# Altium project 通用目标控制板-中.PrjPcb
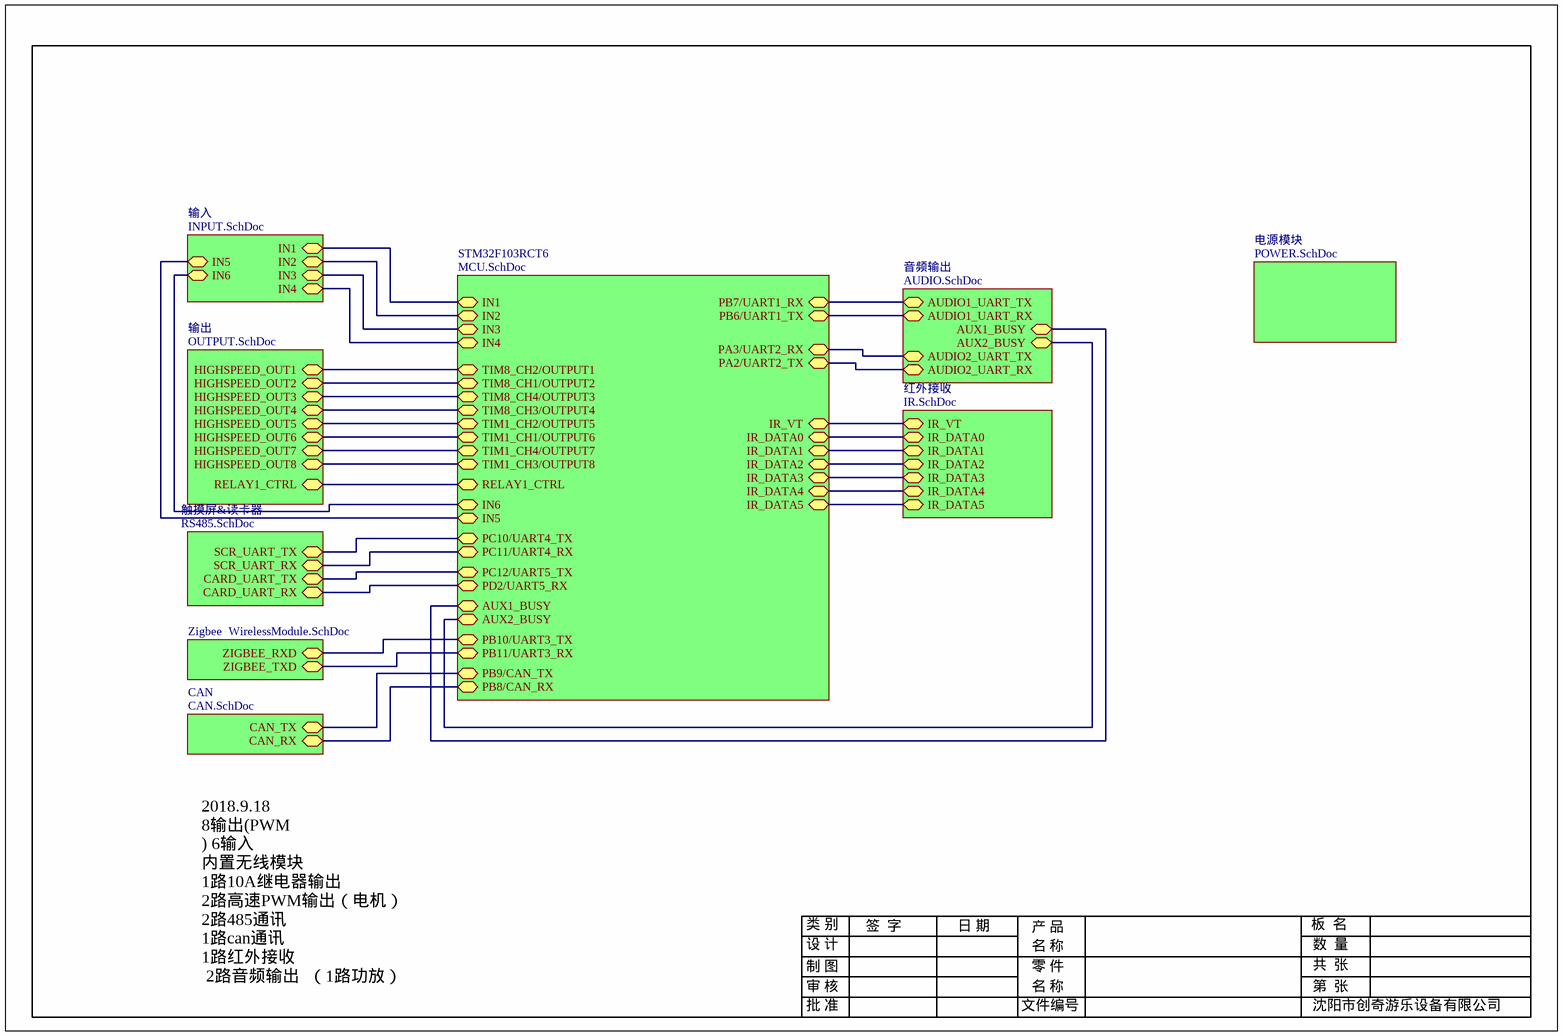
[diagram p0: TOP.SchDoc]
10 sheets, 184 parts. Net scope: hierarchical (ports join the sheet entries above them; power ports are global).
Board file: G12-1A-D-1-2-6-2 目标控制板PCB.PcbDoc
Sheets:
  TOP.SchDoc
    音频输出 = AUDIO.SchDoc
    输入 = INPUT.SchDoc
    红外接收 = IR.SchDoc
    输出 = OUTPUT.SchDoc
    电源模块 = POWER.SchDoc
    STM32F103RCT6 = MCU.SchDoc
    CAN = CAN.SchDoc
    触摸屏&读卡器 = RS485.SchDoc
    Zigbee = WirelessModule.SchDoc

## Sheet TOP.SchDoc
size A4

### Sub-sheets
CAN = CAN.SchDoc: CAN_RX, CAN_TX
STM32F103RCT6 = MCU.SchDoc: TIM8_CH2/OUTPUT1, TIM8_CH1/OUTPUT2, TIM8_CH4/OUTPUT3, TIM8_CH3/OUTPUT4, TIM1_CH2/OUTPUT5, TIM1_CH1/OUTPUT6, TIM1_CH4/OUTPUT7, TIM1_CH3/OUTPUT8, IR_DATA2 (bidir), IR_DATA3 (bidir), IR_DATA5 (bidir), IR_DATA4 (bidir), IR_DATA1 (bidir), IR_DATA0 (bidir), IR_VT (bidir), RELAY1_CTRL (bidir), IN6, IN5, PB8/CAN_RX, PB9/CAN_TX, PC12/UART5_TX, PD2/UART5_RX, AUX1_BUSY, AUX2_BUSY, PC10/UART4_TX, PC11/UART4_RX, IN4, IN3, IN1, IN2, PA3/UART2_RX, PA2/UART2_TX, PB6/UART1_TX, PB7/UART1_RX, PB10/UART3_TX, PB11/UART3_RX
Zigbee = WirelessModule.SchDoc: ZIGBEE_RXD, ZIGBEE_TXD
电源模块 = POWER.SchDoc: no entries
红外接收 = IR.SchDoc: IR_DATA5 (bidir), IR_VT (bidir), IR_DATA0 (bidir), IR_DATA2 (bidir), IR_DATA3 (bidir), IR_DATA4 (bidir), IR_DATA1 (bidir)
触摸屏&读卡器 = RS485.SchDoc: CARD_UART_RX (bidir), CARD_UART_TX (bidir), SCR_UART_TX (bidir), SCR_UART_RX (bidir)
输入 = INPUT.SchDoc: IN2, IN4, IN3, IN1, IN5, IN6
输出 = OUTPUT.SchDoc: HIGHSPEED_OUT1 (bidir), HIGHSPEED_OUT2 (bidir), HIGHSPEED_OUT3 (bidir), HIGHSPEED_OUT4 (bidir), HIGHSPEED_OUT6 (bidir), HIGHSPEED_OUT5 (bidir), HIGHSPEED_OUT7 (bidir), HIGHSPEED_OUT8 (bidir), RELAY1_CTRL (bidir)
音频输出 = AUDIO.SchDoc: AUX1_BUSY, AUX2_BUSY, AUDIO1_UART_TX (bidir), AUDIO1_UART_RX (bidir), AUDIO2_UART_RX (bidir), AUDIO2_UART_TX (bidir)

### Nets
NetR1_2: sheet 输入/IN6, sheet STM32F103RCT6/IN6
NetR2_2: sheet 输入/IN5, sheet STM32F103RCT6/IN5
NetR37_2: sheet 输出/RELAY1_CTRL, sheet STM32F103RCT6/RELAY1_CTRL
NetR52_1: sheet STM32F103RCT6/PC11/UART4_RX, sheet 触摸屏&读卡器/SCR_UART_RX
NetR55_2: sheet STM32F103RCT6/PC10/UART4_TX, sheet 触摸屏&读卡器/SCR_UART_TX
NetR58_1: sheet STM32F103RCT6/PD2/UART5_RX, sheet 触摸屏&读卡器/CARD_UART_RX
NetR61_2: sheet STM32F103RCT6/PC12/UART5_TX, sheet 触摸屏&读卡器/CARD_UART_TX
NetRP2_2: sheet 输入/IN4, sheet STM32F103RCT6/IN4
NetRP2_3: sheet 输入/IN3, sheet STM32F103RCT6/IN3
NetRP2_4: sheet 输入/IN2, sheet STM32F103RCT6/IN2
NetRP2_5: sheet 输入/IN1, sheet STM32F103RCT6/IN1
NetSW2_1: sheet STM32F103RCT6/PB10/UART3_TX, sheet Zigbee/ZIGBEE_RXD
NetSW2_3: sheet STM32F103RCT6/PB11/UART3_RX, sheet Zigbee/ZIGBEE_TXD
NetU2_7: sheet 音频输出/AUDIO1_UART_TX, sheet STM32F103RCT6/PB7/UART1_RX
NetU2_8: sheet 音频输出/AUDIO1_UART_RX, sheet STM32F103RCT6/PB6/UART1_TX
NetU2_9: sheet 音频输出/AUX1_BUSY, sheet STM32F103RCT6/AUX1_BUSY
NetU3_7: sheet 音频输出/AUDIO2_UART_TX, sheet STM32F103RCT6/PA3/UART2_RX
NetU3_8: sheet 音频输出/AUDIO2_UART_RX, sheet STM32F103RCT6/PA2/UART2_TX
NetU3_9: sheet 音频输出/AUX2_BUSY, sheet STM32F103RCT6/AUX2_BUSY
NetU4_1: sheet STM32F103RCT6/PB9/CAN_TX, sheet CAN/CAN_TX
NetU4_4: sheet STM32F103RCT6/PB8/CAN_RX, sheet CAN/CAN_RX
NetU6_7: sheet 红外接收/IR_DATA5, sheet STM32F103RCT6/IR_DATA5
NetU6_8: sheet 红外接收/IR_DATA4, sheet STM32F103RCT6/IR_DATA4
NetU6_12: sheet 红外接收/IR_DATA3, sheet STM32F103RCT6/IR_DATA3
NetU6_13: sheet 红外接收/IR_DATA2, sheet STM32F103RCT6/IR_DATA2
NetU6_14: sheet 红外接收/IR_DATA1, sheet STM32F103RCT6/IR_DATA1
NetU6_15: sheet 红外接收/IR_DATA0, sheet STM32F103RCT6/IR_DATA0
NetU6_19: sheet 红外接收/IR_VT, sheet STM32F103RCT6/IR_VT
NetU8_29: sheet 输出/HIGHSPEED_OUT1, sheet STM32F103RCT6/TIM8_CH2/OUTPUT1
NetU8_30: sheet 输出/HIGHSPEED_OUT2, sheet STM32F103RCT6/TIM8_CH1/OUTPUT2
NetU8_31: sheet 输出/HIGHSPEED_OUT3, sheet STM32F103RCT6/TIM8_CH4/OUTPUT3
NetU8_32: sheet 输出/HIGHSPEED_OUT4, sheet STM32F103RCT6/TIM8_CH3/OUTPUT4
NetU8_33: sheet 输出/HIGHSPEED_OUT5, sheet STM32F103RCT6/TIM1_CH2/OUTPUT5
NetU8_34: sheet 输出/HIGHSPEED_OUT6, sheet STM32F103RCT6/TIM1_CH1/OUTPUT6
NetU8_35: sheet 输出/HIGHSPEED_OUT7, sheet STM32F103RCT6/TIM1_CH4/OUTPUT7
NetU8_36: sheet 输出/HIGHSPEED_OUT8, sheet STM32F103RCT6/TIM1_CH3/OUTPUT8

### Notes on the sheet
- 2018.9.18
  8输出(PWM
  ) 6输入
  内置无线模块
  1路10A继电器输出
  2路高速PWM输出（电机）
  2路485通讯
  1路can通讯
  1路红外接收
  2路音频输出  （1路功放）
- 设 计
- 制 图
- 审 核
- 类 别
- 签  字
- 日 期
- 产 品
- 名 称
- 零 件
- 板  名
- 数  量
- 共  张
- 第  张
- 批 准
- 文件编号
- 沈阳市创奇游乐设备有限公司

## Sheet AUDIO.SchDoc
size A4
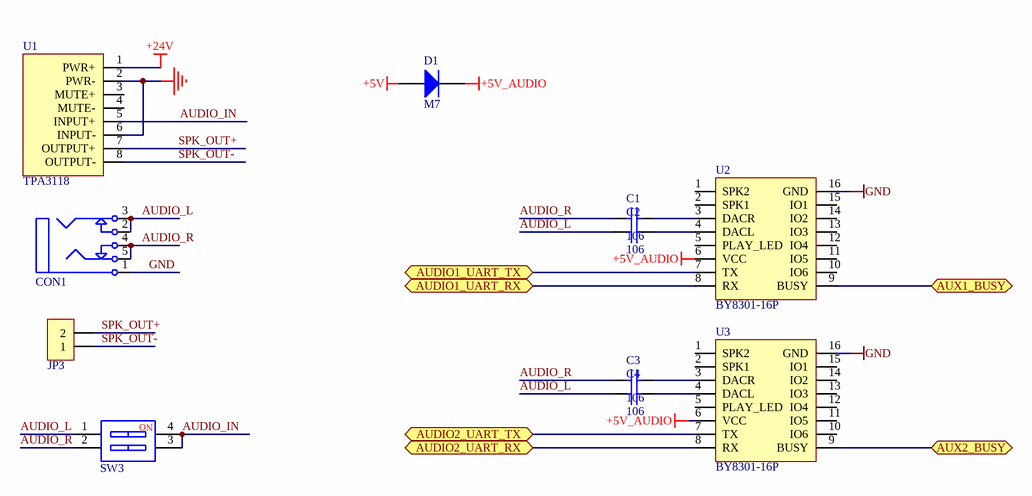
[diagram p1: AUDIO.SchDoc]

### Parts
C1  106  [C 1206]
C2  106  [C 1206]
C3  106  [C 1206]
C4  106  [C 1206]
CON1  PJ325_BK  [PJ325_PK]  (value not drawn)
D1  M7  [SMA]
JP3  AUX  [557-2X1]  (value not drawn)
SW3  CSW-2P  [CSW1.27 SMD-2P]  (value not drawn)
U1  TPA3118  [TPA3118-L]
U2  BY8301-16P  [BY8301-16P]
U3  BY8301-16P  [BY8301-16P]

### Ports
AUDIO1_UART_RX (bidir), AUDIO1_UART_TX (bidir), AUDIO2_UART_RX (bidir), AUDIO2_UART_TX (bidir), AUX1_BUSY, AUX2_BUSY

### Nets
+5V: D1.1
+5V_AUDIO: D1.2 U2.6(VCC) U3.6(VCC)
+24V: U1.1(PWR+)
GND: CON1.1 U1.2(PWR-) U1.6(INPUT-) U2.16(GND) U3.16(GND)
AUDIO_IN: SW3.3 SW3.4 U1.5(INPUT+)
AUDIO_L: C2.1 C4.1 CON1.2 CON1.3 SW3.1
AUDIO_R: C1.1 C3.1 CON1.4 CON1.5 SW3.2
SPK_OUT+: JP3.2 U1.7(OUTPUT+)
SPK_OUT-: JP3.1 U1.8(OUTPUT-)
NetC1_2: C1.2 U2.3(DACR)
NetC2_2: C2.2 U2.4(DACL)
NetC3_2: C3.2 U3.3(DACR)
NetC4_2: C4.2 U3.4(DACL)
NetU2_7: U2.7(TX) ; port AUDIO1_UART_TX
NetU2_8: U2.8(RX) ; port AUDIO1_UART_RX
NetU2_9: U2.9(BUSY) ; port AUX1_BUSY
NetU3_7: U3.7(TX) ; port AUDIO2_UART_TX
NetU3_8: U3.8(RX) ; port AUDIO2_UART_RX
NetU3_9: U3.9(BUSY) ; port AUX2_BUSY

Not connected (* = marked no-connect by the designer): U1 3(MUTE+) 4(MUTE-); U2 1(SPK2) 2(SPK1) 5(PLAY_LED) 10(IO6) 11(IO5) 12(IO4) 13(IO3) 14(IO2) 15(IO1); U3 1(SPK2) 2(SPK1) 5(PLAY_LED) 10(IO6) 11(IO5) 12(IO4) 13(IO3) 14(IO2) 15(IO1)

### Notes on the sheet
- 设 计
- 制 图
- 审 核
- 类 别
- 签  字
- 日 期
- 产 品
- 名 称
- 零 件
- 板  名
- 数  量
- 共  张
- 第  张
- 批 准
- 文件编号
- 沈阳市创奇游乐设备有限公司
- (in symbol CSW-2P) NO

### Library data of the parts
C1-C4 = Cap: Capacitor; Published: 8-Jun-2000; LatestRevisionDate: 17-Jul-2002; LatestRevisionNote: Re-released for DXP Platform.; Publisher: Altium Limited
CON1 = PJ325: 3.5mm耳机插座; BOM名称: 耳机插座; 版权归属: 源创客; 学习资源: www.ooocke.com
D1 = Diode
JP3 = Header 2: 2P接插件; 版权归属: 源创客; BOM名称: 2P接插件; 学习资源: www.ooocke.com
SW3 = CSW-2P: 2路编码开关; 版权归属: 源创客; BOM名称: 2路编码开关; 学习资源: www.ooocke.com
U1 = TPA3118: TPA3118单声道功放板
U2 U3 = BY8301-16P: BY8001-16P语音模块

## Sheet INPUT.SchDoc
size A4
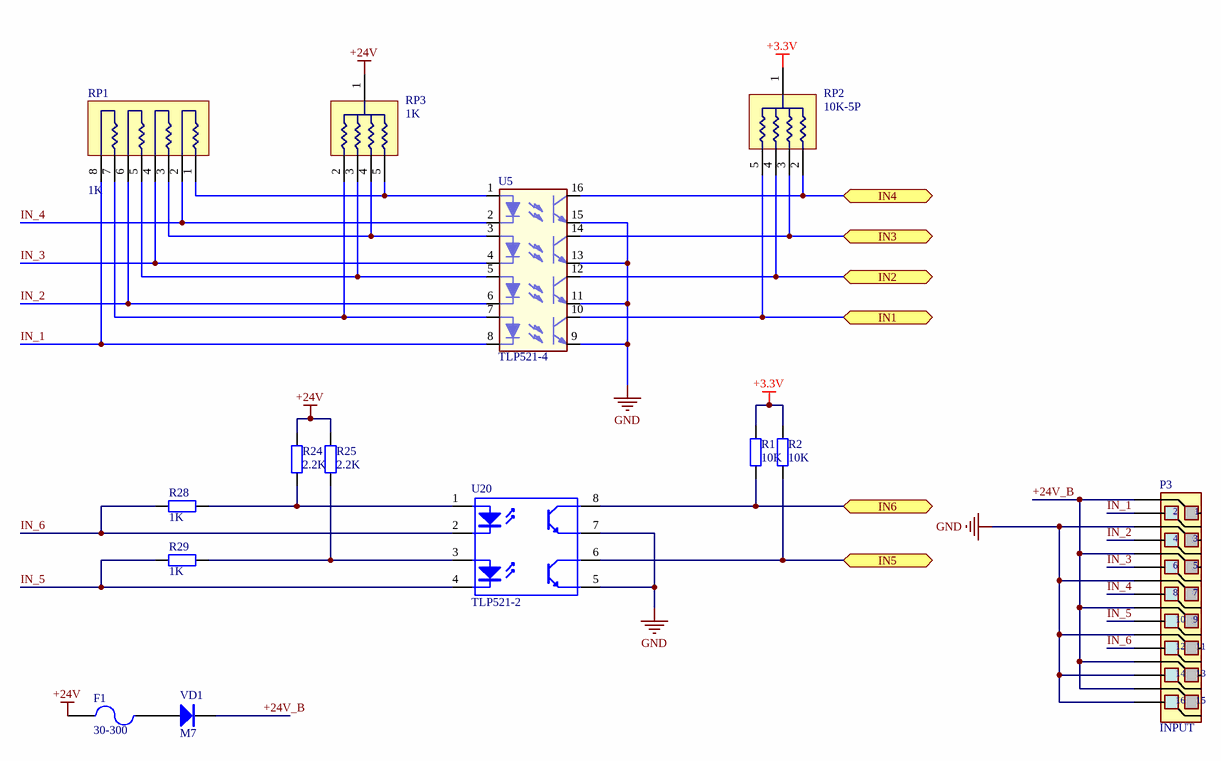
[diagram p2: INPUT.SchDoc]

### Parts
F1  30-300  [FU 1812]
P3  INPUT  [557-2x8]
R1  10K  [R 0805]
R2  10K  [R 0805]
R24  2.2K  [R 0805]
R25  2.2K  [R 0805]
R28  1K  [R 0805]
R29  1K  [R 0805]
RP1  1K  [HDR1X8_1]
RP2  10K-5P  [HDR1X5_1]
RP3  1K  [HDR1X5_1]
U5  TLP521-4  [DIP16-300_MH]
U20  TLP521-2  [DIP8-300_MH]
VD1  M7  [SMA]

### Ports
IN1, IN2, IN3, IN4, IN5, IN6

### Nets
+3.3V: R1.1 R2.1 RP2.1
+24V: F1.1 R24.1 R25.1 RP3.1
GND: P3.3 P3.7 P3.11 P3.14 P3.16 U5.9 U5.11 U5.13 U5.15 U20.5(2E) U20.7(1E)
+24V_B: P3.1 P3.5 P3.9 P3.13 P3.15 VD1.2(K)
IN_1: P3.2 RP1.8 U5.8
IN_2: P3.4 RP1.6 U5.6
IN_3: P3.6 RP1.4 U5.4
IN_4: P3.8 RP1.2 U5.2
IN_5: P3.10 R29.1 U20.4(2K)
IN_6: P3.12 R28.1 U20.2(1K)
NetF1_2: F1.2 VD1.1(A)
NetR1_2: R1.2 U20.8(1C) ; port IN6
NetR2_2: R2.2 U20.6(2C) ; port IN5
NetR24_2: R24.2 R28.2 U20.1(1A)
NetR25_2: R25.2 R29.2 U20.3(2A)
NetRP1_1: RP1.1 RP3.5 U5.1
NetRP1_3: RP1.3 RP3.4 U5.3
NetRP1_5: RP1.5 RP3.3 U5.5
NetRP1_7: RP1.7 RP3.2 U5.7
NetRP2_2: RP2.2 U5.16 ; port IN4
NetRP2_3: RP2.3 U5.14 ; port IN3
NetRP2_4: RP2.4 U5.12 ; port IN2
NetRP2_5: RP2.5 U5.10 ; port IN1

### Notes on the sheet
- 设 计
- 制 图
- 审 核
- 类 别
- 签  字
- 日 期
- 产 品
- 名 称
- 零 件
- 板  名
- 数  量
- 共  张
- 第  张
- 批 准
- 文件编号
- 沈阳市创奇游乐设备有限公司

### Library data of the parts
F1 = Fuse 2: Fuse; Published: 8-Jun-2000; LatestRevisionDate: 17-Jul-2002; LatestRevisionNote: Re-released for DXP Platform.; PackageReference: PIN-W2/E2.8; Publisher: Altium Limited
P3 = 557-2x8: 接插件
R1 R2 R24 R25 R28 R29 = Res1
RP1 = Res_Pack4_SIP8
RP2 RP3 = Res4
U5 = OPTOISOLATOR1_4A
U20 = TLP521-2: 2路开关光耦; 版权归属: 源创客; BOM名称: 2路开关光耦; 学习资源: www.ooocke.com
VD1 = M7: 整流二极管; 版权归属: 源创客; BOM名称: 整流二极管; 学习资源: www.ooocke.com

## Sheet IR.SchDoc
size A4
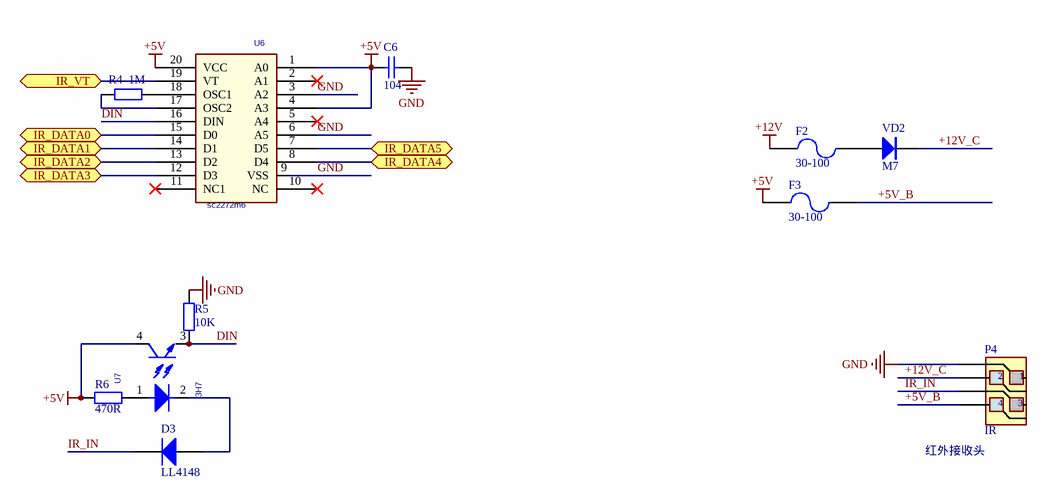
[diagram p3: IR.SchDoc]

### Parts
C6  104  [C 0805]
D3  LL4148  [MINI_MELF (LL34)]
F2  30-100  [FU 1812]
F3  30-100  [FU 1812]
P4  IR  [557-2x2]
R4  1M  [R 0805]
R5  10K  [R 0805]
R6  470R  [R 0805]
U6  sc2272m6  [SOP20_N]
U7  3H7  [SOP4_3H7]
VD2  M7  [SMA]

### Ports
IR_DATA0 (bidir), IR_DATA1 (bidir), IR_DATA2 (bidir), IR_DATA3 (bidir), IR_DATA4 (bidir), IR_DATA5 (bidir), IR_VT (bidir)

### Nets
+5V: C6.2 F3.1 R6.2 U6.1(A0) U6.4(A3) U6.20(VCC) U7.4(COLLECTOR)
+12V: F2.1
GND: C6.1 P4.1 R5.2 U6.3(A2) U6.6(A5) U6.9(VSS)
+5V_B: F3.2 P4.4
+12V_C: P4.2 VD2.2(K)
DIN: R5.1 U6.16(DIN) U7.3(EMITTER)
IR_IN: D3.2 P4.3
NetD3_1: D3.1 U7.2(CATHODE)
NetF2_2: F2.2 VD2.1(A)
NetR4_1: R4.1 U6.17(OSC2)
NetR4_2: R4.2 U6.18(OSC1)
NetR6_1: R6.1 U7.1(ANODE)
NetU6_7: U6.7(D5) ; port IR_DATA5
NetU6_8: U6.8(D4) ; port IR_DATA4
NetU6_12: U6.12(D3) ; port IR_DATA3
NetU6_13: U6.13(D2) ; port IR_DATA2
NetU6_14: U6.14(D1) ; port IR_DATA1
NetU6_15: U6.15(D0) ; port IR_DATA0
NetU6_19: U6.19(VT) ; port IR_VT

Not connected (* = marked no-connect by the designer): U6 2(A1)* 5(A4)* 10(NC)* 11(NC1)*

### Notes on the sheet
- (near P4) 红外接收头
- 设 计
- 制 图
- 审 核
- 类 别
- 签  字
- 日 期
- 产 品
- 名 称
- 零 件
- 板  名
- 数  量
- 共  张
- 第  张
- 批 准
- 文件编号
- 沈阳市创奇游乐设备有限公司

### Library data of the parts
C6 = Cap1
D3 = Diode
F2 F3 = Fuse 2: Fuse; Published: 8-Jun-2000; LatestRevisionDate: 17-Jul-2002; LatestRevisionNote: Re-released for DXP Platform.; PackageReference: PIN-W2/E2.8; Publisher: Altium Limited
P4 = 557-2x2: 接插件
R4 = Res2: Resistor; Published: 8-Jun-2000; LatestRevisionDate: 17-Jul-2002; LatestRevisionNote: Re-released for DXP Platform.; Publisher: Altium Limited
R5 R6 = Res1
U6 = PT2272_L6S
U7 = PS2801-1/SM
VD2 = M7: 整流二极管; 版权归属: 源创客; BOM名称: 整流二极管; 学习资源: www.ooocke.com

## Sheet OUTPUT.SchDoc
size A4
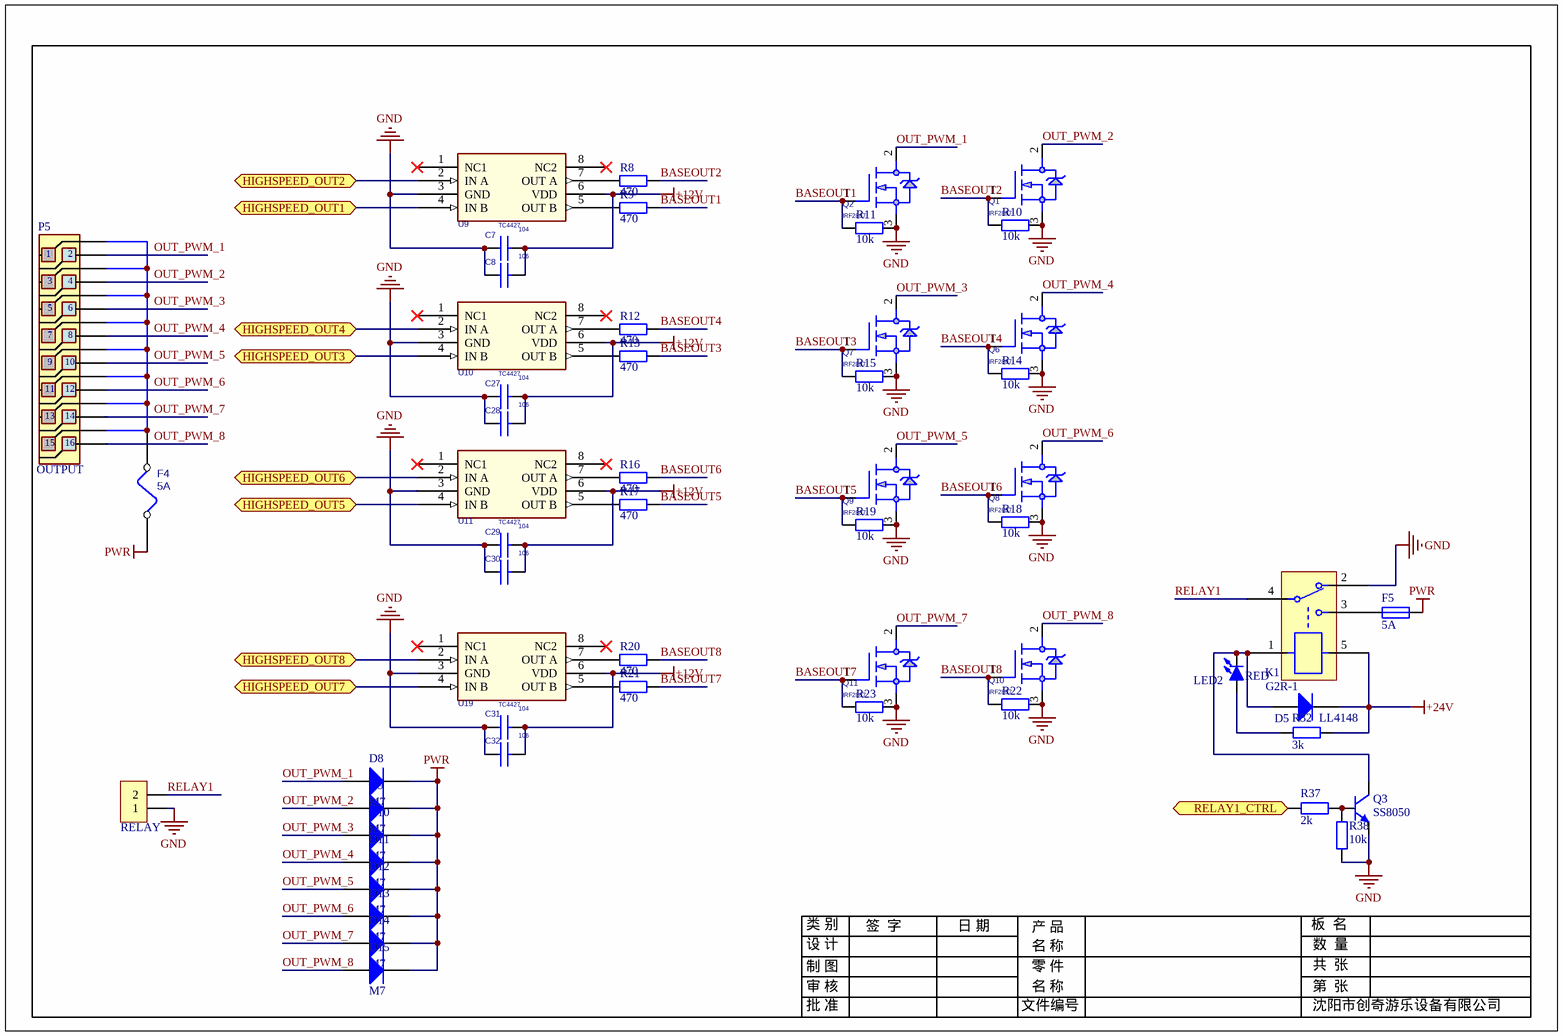
[diagram p4: OUTPUT.SchDoc]

### Parts
C7  104  [C 0805]
C8  106  [C 0805]
C27  104  [C 0805]
C28  106  [C 0805]
C29  104  [C 0805]
C30  106  [C 0805]
C31  104  [C 0805]
C32  106  [C 0805]
D5  LL4148  [MINI_MELF (LL34)]
D8  M7  [SMA]
D9  M7  [SMA]
D10  M7  [SMA]
D11  M7  [SMA]
D12  M7  [SMA]
D13  M7  [SMA]
D14  M7  [SMA]
D15  M7  [SMA]
F4  5A  [FUSEe-CAR]
F5  5A  [FUSEe-CAR]
K1  G2R-1  [RELAY_OMRON_G2R]
LED2  RED  [LED 3MM-R]
P5  OUTPUT  [557-2x8]
Q1  IRF2807  [TO220A]
Q2  IRF2807  [TO220A]
Q3  SS8050  [SOT23-3N]
Q6  IRF2807  [TO220A]
Q7  IRF2807  [TO220A]
Q8  IRF2807  [TO220A]
Q9  IRF2807  [TO220A]
Q10  IRF2807  [TO220A]
Q11  IRF2807  [TO220A]
R8  470  [R 0805]
R9  470  [R 0805]
R10  10k  [R 0805]
R11  10k  [R 0805]
R12  470  [R 0805]
R13  470  [R 0805]
R14  10k  [R 0805]
R15  10k  [R 0805]
R16  470  [R 0805]
R17  470  [R 0805]
R18  10k  [R 0805]
R19  10k  [R 0805]
R20  470  [R 0805]
R21  470  [R 0805]
R22  10k  [R 0805]
R23  10k  [R 0805]
R32  3k  [R 0805]
R37  2k  [R 0805]
R38  10k  [R 0805]
RELAY  AUX  [557-2X1]  (value not drawn)
U9  TC4427  [SO8]
U10  TC4427  [SO8]
U11  TC4427  [SO8]
U19  TC4427  [SO8]

### Ports
HIGHSPEED_OUT1 (bidir), HIGHSPEED_OUT2 (bidir), HIGHSPEED_OUT3 (bidir), HIGHSPEED_OUT4 (bidir), HIGHSPEED_OUT5 (bidir), HIGHSPEED_OUT6 (bidir), HIGHSPEED_OUT7 (bidir), HIGHSPEED_OUT8 (bidir), RELAY1_CTRL (bidir)

### Nets
+12V: C7.2 C8.2 C27.2 C28.2 C29.2 C30.2 C31.2 C32.2 U9.6(VDD) U10.6(VDD) U11.6(VDD) U19.6(VDD)
+24V: D5.2 K1.5 R32.1
GND: C7.1 C8.1 C27.1 C28.1 C29.1 C30.1 C31.1 C32.1 K1.2 Q1.3(S) Q2.3(S) Q3.2(E) Q6.3(S) Q7.3(S) Q8.3(S) Q9.3(S) Q10.3(S) Q11.3(S) R10.2 R11.2 R14.2 R15.2 R18.2 R19.2 R22.2 R23.2 R38.2 RELAY.1 U9.3(GND) U10.3(GND) U11.3(GND) U19.3(GND)
PWR: D8.2 D9.2 D10.2 D11.2 D12.2 D13.2 D14.2 D15.2 F4.1 F5.2
BASEOUT1: Q2.1(G) R9.2 R11.1
BASEOUT2: Q1.1(G) R8.2 R10.1
BASEOUT3: Q7.1(G) R13.2 R15.1
BASEOUT4: Q6.1(G) R12.2 R14.1
BASEOUT5: Q9.1(G) R17.2 R19.1
BASEOUT6: Q8.1(G) R16.2 R18.1
BASEOUT7: Q11.1(G) R21.2 R23.1
BASEOUT8: Q10.1(G) R20.2 R22.1
OUT_PWM_1: D8.1 P5.2 Q2.2(D)
OUT_PWM_2: D9.1 P5.4 Q1.2(D)
OUT_PWM_3: D10.1 P5.6 Q7.2(D)
OUT_PWM_4: D11.1 P5.8 Q6.2(D)
OUT_PWM_5: D12.1 P5.10 Q9.2(D)
OUT_PWM_6: D13.1 P5.12 Q8.2(D)
OUT_PWM_7: D14.1 P5.14 Q11.2(D)
OUT_PWM_8: D15.1 P5.16 Q10.2(D)
RELAY1: K1.4 RELAY.2
NetD5_1: D5.1 K1.1 LED2.2(K) Q3.3(C)
NetF4_2: F4.2 P5.1 P5.3 P5.5 P5.7 P5.9 P5.11 P5.13 P5.15
NetF5_1: F5.1 K1.3
NetLED2_1: LED2.1(A) R32.2
NetQ3_1: Q3.1(B) R37.1 R38.1
NetR8_1: R8.1 U9.7(OUT_A)
NetR9_1: R9.1 U9.5(OUT_B)
NetR12_1: R12.1 U10.7(OUT_A)
NetR13_1: R13.1 U10.5(OUT_B)
NetR16_1: R16.1 U11.7(OUT_A)
NetR17_1: R17.1 U11.5(OUT_B)
NetR20_1: R20.1 U19.7(OUT_A)
NetR21_1: R21.1 U19.5(OUT_B)
NetR37_2: R37.2 ; port RELAY1_CTRL
NetU8_29: U9.4(IN_B) ; port HIGHSPEED_OUT1
NetU8_30: U9.2(IN_A) ; port HIGHSPEED_OUT2
NetU8_31: U10.4(IN_B) ; port HIGHSPEED_OUT3
NetU8_32: U10.2(IN_A) ; port HIGHSPEED_OUT4
NetU8_33: U11.4(IN_B) ; port HIGHSPEED_OUT5
NetU8_34: U11.2(IN_A) ; port HIGHSPEED_OUT6
NetU8_35: U19.4(IN_B) ; port HIGHSPEED_OUT7
NetU8_36: U19.2(IN_A) ; port HIGHSPEED_OUT8

Not connected (* = marked no-connect by the designer): U9 1(NC1)* 8(NC2)*; U10 1(NC1)* 8(NC2)*; U11 1(NC1)* 8(NC2)*; U19 1(NC1)* 8(NC2)*

### Notes on the sheet
- 设 计
- 制 图
- 审 核
- 类 别
- 签  字
- 日 期
- 产 品
- 名 称
- 零 件
- 板  名
- 数  量
- 共  张
- 第  张
- 批 准
- 文件编号
- 沈阳市创奇游乐设备有限公司

### Library data of the parts
C7 C8 C27-C32 = CAP NP
D5 D8-D15 = Diode
F4 = FUSE
F5 = FUSE1: Fuse
K1 = Relay2
LED2 = LED-SMD: 贴片LED; 版权归属: 源创客; BOM名称: 贴片LED; 学习资源: www.ooocke.com
P5 = 557-2x8: 接插件
Q1 Q2 Q6-Q11 = MOSFET N-Channel
Q3 = 8050-SMD: 高频放大-NPN型; 版权归属: 源创客; 属性: 40V 1.5A 1W 100MHZ; BOM名称: 高频放大-NPN型; 学习资源: www.ooocke.com
R8-R23 = Res1
R32 R37 R38 = R: 贴片电阻; 版权归属: 源创客; BOM名称: 贴片电阻; 学习资源: www.ooocke.com
RELAY = Header 2: 2P接插件; 版权归属: 源创客; BOM名称: 2P接插件; 学习资源: www.ooocke.com
U9-U11 U19 = TC4427EPA

## Sheet POWER.SchDoc
size A4
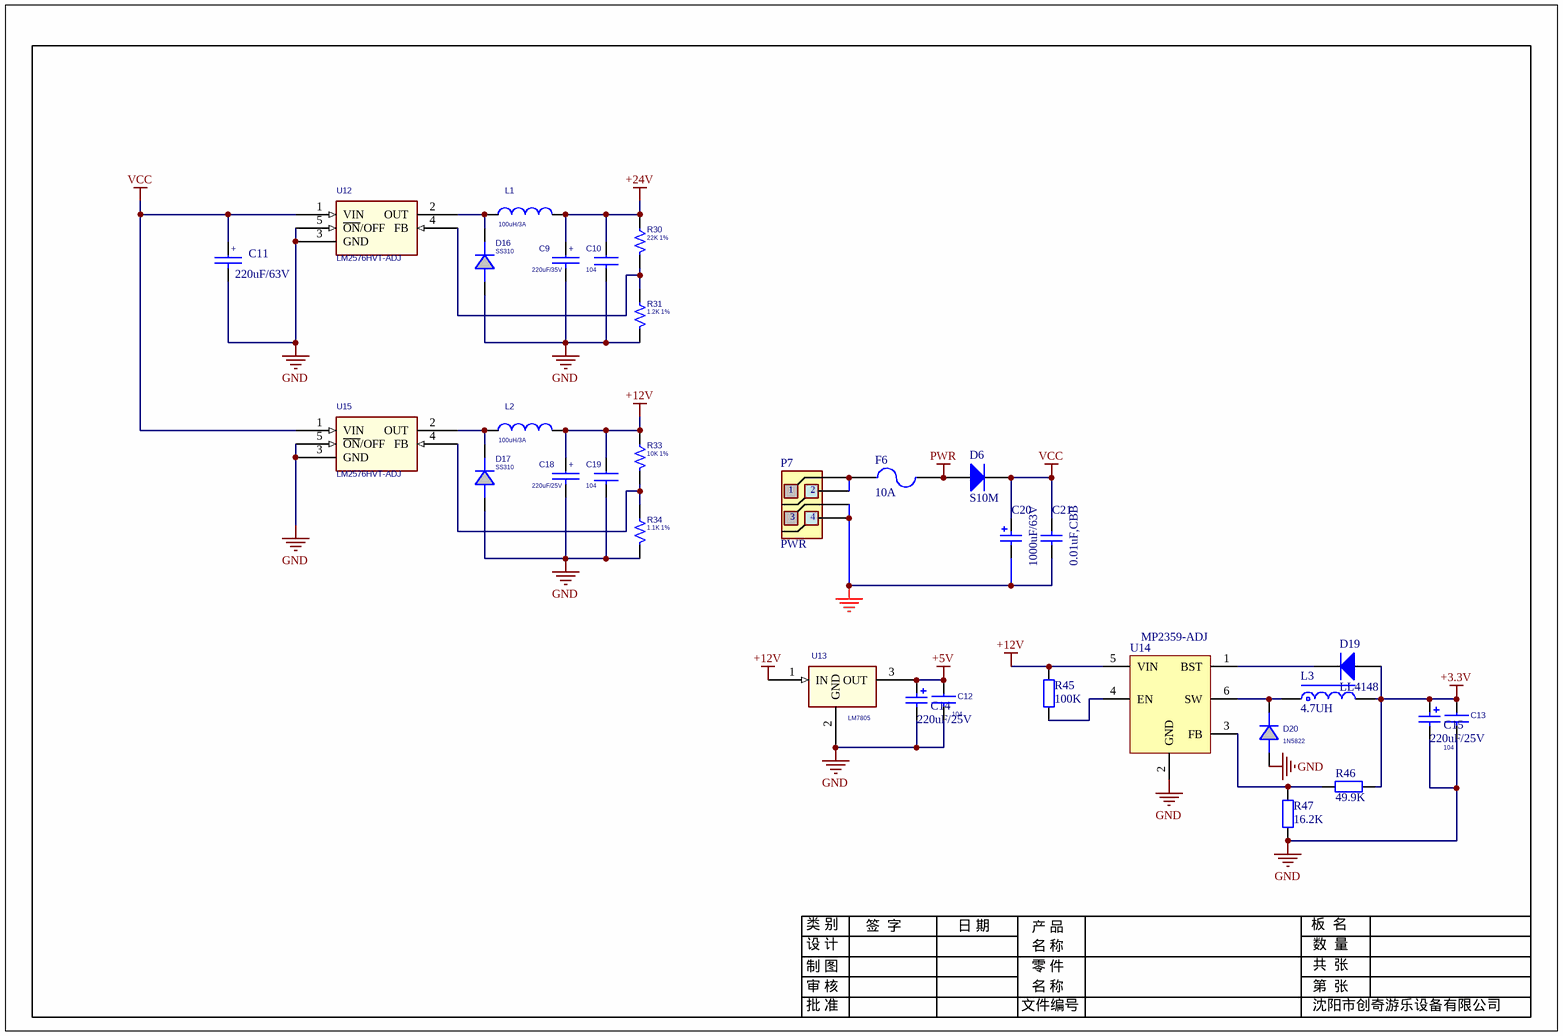
[diagram p5: POWER.SchDoc]

### Parts
C9  220uF/35V  [CAP 3.5*8*11.5]
C10  104  [C 0805]
C11  220uF/63V  [CAP 5.0*10*16]
C12  104  [C 0805]
C13  104  [C 0805]
C14  220uF/25V  [CAP 2.5*6.3*11.2 - BK]
C15  220uF/25V  [CAP 2.5*6.3*11.2 - BK]
C18  220uF/25V  [CAP 2.5*6.3*7]
C19  104  [C 0805]
C20  1000uF/63V  [CAP 7.5*16*25]
C21  0.01uF,CBB  [MLCC5.08-A]
D6  S10M  [SMC]
D16  SS310  [SMC]
D17  SS310  [SMC]
D19  LL4148  [MINI_MELF (LL34)]
D20  1N5822  [SMA]
F6  10A  [FUSEe-CAR]
L1  100uH/3A  [PK1618]
L2  100uH/3A  [PK1618]
L3  4.7UH  [CD31]
P7  PWR  [557-2x2]
R30  22K 1%  [R 0805]
R31  1.2K 1%  [R 0805]
R33  10K 1%  [R 0805]
R34  1.1K 1%  [R 0805]
R45  100K  [R 0805]
R46  49.9K  [R 0805]
R47  16.2K  [R 0805]
U12  LM2576HVT-ADJ  [TO220-5]
U13  LM7805  [TO220A]
U14  MP2359-ADJ  [SOT23-6L]
U15  LM2576HVT-ADJ  [TO220-5]

### Nets
+3.3V: C13.1 C15.1 D19.1 L3.2 R46.2
+5V: C12.1 C14.1 U13.3(OUT)
+12V: C18.1 C19.1 L2.2 R33.1 R45.1 U13.1(IN) U14.5(VIN)
+24V: C9.1 C10.1 L1.2 R30.1
GND: C9.2 C10.2 C11.2 C12.2 C13.2 C14.2 C15.2 C18.2 C19.2 C20.2 C21.1 D16.1(ANODE) D17.1(ANODE) D20.1(ANODE) P7.3 P7.4 R31.2 R34.2 R47.2 U12.3(GND) U12.5(~{ON}/OFF) U13.2(GND) U14.2(GND) U15.3(GND) U15.5(~{ON}/OFF)
PWR: D6.1 F6.1
VCC: C11.1 C20.1 C21.2 D6.2 U12.1(VIN) U15.1(VIN)
NetD16_2: D16.2(CATHODE) L1.1 U12.2(OUT)
NetD17_2: D17.2(CATHODE) L2.1 U15.2(OUT)
NetD19_2: D19.2 U14.1(BST)
NetD20_2: D20.2(CATHODE) L3.1 U14.6(SW)
NetF6_2: F6.2 P7.1 P7.2
NetR30_2: R30.2 R31.1 U12.4(FB)
NetR33_2: R33.2 R34.1 U15.4(FB)
NetR45_2: R45.2 U14.4(EN)
NetR46_1: R46.1 R47.1 U14.3(FB)

### Notes on the sheet
- 设 计
- 制 图
- 审 核
- 类 别
- 签  字
- 日 期
- 产 品
- 名 称
- 零 件
- 板  名
- 数  量
- 共  张
- 第  张
- 批 准
- 文件编号
- 沈阳市创奇游乐设备有限公司
- (in symbol CAP POL_3) +
- (in symbol CAP POL_4_1) +

### Library data of the parts
C9 C18 = CAP POL_3: 100uF/16V,100uF/35V; 100uF/16V: 100uF/16V; 100uF/35V: 100uF/35V
C10 C12 C13 C19 = CAP NP
C11 = CAP POL_4_1: 220uF/63V,470uF/50V; 470uF/50V: 470uF/50V; 220uF/63V: 220uF/63V
C14 C15 C20 = Cap Pol2: Polarized Capacitor (Axial); Published: 8-Jun-2000; LatestRevisionDate: 17-Jul-2002; LatestRevisionNote: Re-released for DXP Platform.; Publisher: Altium Limited
C21 = Cap: Capacitor; Published: 8-Jun-2000; LatestRevisionDate: 17-Jul-2002; LatestRevisionNote: Re-released for DXP Platform.; Publisher: Altium Limited
D6 D19 = Diode
D16 D17 = DIODE_1: S3M: S3M; SS310: SS310
D20 = DIODE
F6 = Fuse 2: Fuse; Published: 8-Jun-2000; LatestRevisionDate: 17-Jul-2002; LatestRevisionNote: Re-released for DXP Platform.; PackageReference: PIN-W2/E2.8; Publisher: Altium Limited
L1 L2 = INDUCTOR_2
L3 = L-CD: 贴片功率电感; BOM名称: 功率电感; 版权归属: 源创客; 学习资源: www.ooocke.com
P7 = CON4L
R30 R31 R33 R34 = RESISTOR 1
R45-R47 = Res1
U14 = MP2359: 输入：4.5V-24V  输出：0-15V 1.2A

## Sheet MCU.SchDoc
size A4
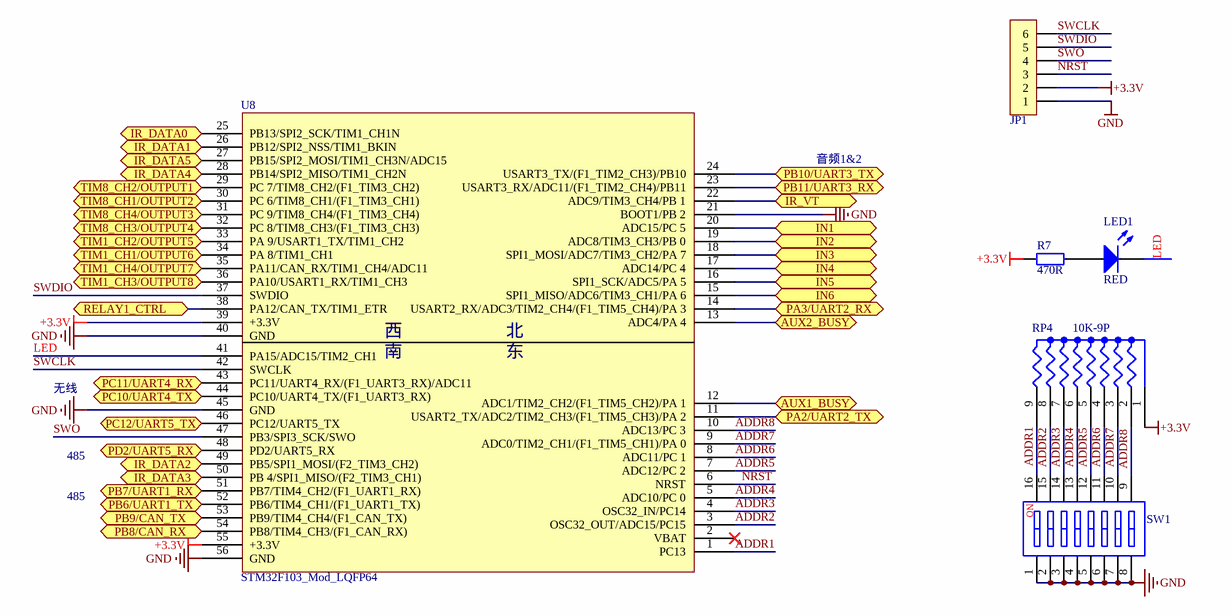
[diagram p6: MCU.SchDoc]

### Parts
JP1  HDR-1X6  [XH2.54-6P]  (value not drawn)
LED1  RED  [LED 5MM-R]
R7  470R  [R 0805]
RP4  10K-9P  [HDR1X9_1]
SW1  CSW-8P  [CSW DIP-8P_G]  (value not drawn)
U8  STM32F103_Mod_LQFP64  [STM32F103_LQFP64]

### Ports
AUX1_BUSY, AUX2_BUSY, IN1, IN2, IN3, IN4, IN5, IN6, IR_DATA0 (bidir), IR_DATA1 (bidir), IR_DATA2 (bidir), IR_DATA3 (bidir), IR_DATA4 (bidir), IR_DATA5 (bidir), IR_VT (bidir), PA2/UART2_TX, PA3/UART2_RX, PB6/UART1_TX, PB7/UART1_RX, PB8/CAN_RX, PB9/CAN_TX, PB10/UART3_TX, PB11/UART3_RX, PC10/UART4_TX, PC11/UART4_RX, PC12/UART5_TX, PD2/UART5_RX, RELAY1_CTRL (bidir), TIM1_CH1/OUTPUT6, TIM1_CH2/OUTPUT5, TIM1_CH3/OUTPUT8, TIM1_CH4/OUTPUT7, TIM8_CH1/OUTPUT2, TIM8_CH2/OUTPUT1, TIM8_CH3/OUTPUT4, TIM8_CH4/OUTPUT3

### Nets
+3.3V: JP1.2 R7.2 RP4.1 U8.39(+3.3V) U8.55(+3.3V)
GND: JP1.1 SW1.1 SW1.2 SW1.3 SW1.4 SW1.5 SW1.6 SW1.7 SW1.8 U8.21(BOOT1/PB_2) U8.40(GND) U8.45(GND) U8.56(GND)
ADDR1: RP4.9 SW1.16 U8.1(PC13)
ADDR2: RP4.8 SW1.15 U8.3(OSC32_OUT/ADC15/PC15)
ADDR3: RP4.7 SW1.14 U8.4(OSC32_IN/PC14)
ADDR4: RP4.6 SW1.13 U8.5(ADC10/PC_0)
ADDR5: RP4.5 SW1.12 U8.7(ADC12/PC_2)
ADDR6: RP4.4 SW1.11 U8.8(ADC11/PC_1)
ADDR7: RP4.3 SW1.10 U8.9(ADC0/TIM2_CH1/(F1_TIM5_CH1)/PA_0)
ADDR8: RP4.2 SW1.9 U8.10(ADC13/PC_3)
LED: LED1.2(K) U8.41(PA15/ADC15/TIM2_CH1)
NRST: JP1.3 U8.6(NRST)
SWCLK: JP1.6 U8.42(SWCLK)
SWDIO: JP1.5 U8.37(SWDIO)
SWO: JP1.4 U8.47(PB3/SPI3_SCK/SWO)
NetLED1_1: LED1.1(A) R7.1
NetR1_2: U8.15(SPI1_MISO/ADC6/TIM3_CH1/PA_6) ; port IN6
NetR2_2: U8.16(SPI1_SCK/ADC5/PA_5) ; port IN5
NetR37_2: U8.38(PA12/CAN_TX/TIM1_ETR) ; port RELAY1_CTRL
NetR52_1: U8.43(PC11/UART4_RX/(F1_UART3_RX)/ADC11) ; port PC11/UART4_RX
NetR55_2: U8.44(PC10/UART4_TX/(F1_UART3_RX)) ; port PC10/UART4_TX
NetR58_1: U8.48(PD2/UART5_RX) ; port PD2/UART5_RX
NetR61_2: U8.46(PC12/UART5_TX) ; port PC12/UART5_TX
NetRP2_2: U8.17(ADC14/PC_4) ; port IN4
NetRP2_3: U8.18(SPI1_MOSI/ADC7/TIM3_CH2/PA_7) ; port IN3
NetRP2_4: U8.19(ADC8/TIM3_CH3/PB_0) ; port IN2
NetRP2_5: U8.20(ADC15/PC_5) ; port IN1
NetSW2_1: U8.24(USART3_TX/(F1_TIM2_CH3)/PB10) ; port PB10/UART3_TX
NetSW2_3: U8.23(USART3_RX/ADC11/(F1_TIM2_CH4)/PB11) ; port PB11/UART3_RX
NetU2_7: U8.51(PB7/TIM4_CH2/(F1_UART1_RX)) ; port PB7/UART1_RX
NetU2_8: U8.52(PB6/TIM4_CH1/(F1_UART1_TX)) ; port PB6/UART1_TX
NetU2_9: U8.12(ADC1/TIM2_CH2/(F1_TIM5_CH2)/PA_1) ; port AUX1_BUSY
NetU3_7: U8.14(USART2_RX/ADC3/TIM2_CH4/(F1_TIM5_CH4)/PA_3) ; port PA3/UART2_RX
NetU3_8: U8.11(USART2_TX/ADC2/TIM2_CH3/(F1_TIM5_CH3)/PA_2) ; port PA2/UART2_TX
NetU3_9: U8.13(ADC4/PA_4) ; port AUX2_BUSY
NetU4_1: U8.53(PB9/TIM4_CH4/(F1_CAN_TX)) ; port PB9/CAN_TX
NetU4_4: U8.54(PB8/TIM4_CH3/(F1_CAN_RX)) ; port PB8/CAN_RX
NetU6_7: U8.27(PB15/SPI2_MOSI/TIM1_CH3N/ADC15) ; port IR_DATA5
NetU6_8: U8.28(PB14/SPI2_MISO/TIM1_CH2N) ; port IR_DATA4
NetU6_12: U8.50(PB_4/SPI1_MISO/(F2_TIM3_CH1)) ; port IR_DATA3
NetU6_13: U8.49(PB5/SPI1_MOSI/(F2_TIM3_CH2)) ; port IR_DATA2
NetU6_14: U8.26(PB12/SPI2_NSS/TIM1_BKIN) ; port IR_DATA1
NetU6_15: U8.25(PB13/SPI2_SCK/TIM1_CH1N) ; port IR_DATA0
NetU6_19: U8.22(ADC9/TIM3_CH4/PB_1) ; port IR_VT
NetU8_29: U8.29(PC_7/TIM8_CH2/(F1_TIM3_CH2)) ; port TIM8_CH2/OUTPUT1
NetU8_30: U8.30(PC_6/TIM8_CH1/(F1_TIM3_CH1)) ; port TIM8_CH1/OUTPUT2
NetU8_31: U8.31(PC_9/TIM8_CH4/(F1_TIM3_CH4)) ; port TIM8_CH4/OUTPUT3
NetU8_32: U8.32(PC_8/TIM8_CH3/(F1_TIM3_CH3)) ; port TIM8_CH3/OUTPUT4
NetU8_33: U8.33(PA_9/USART1_TX/TIM1_CH2) ; port TIM1_CH2/OUTPUT5
NetU8_34: U8.34(PA_8/TIM1_CH1) ; port TIM1_CH1/OUTPUT6
NetU8_35: U8.35(PA11/CAN_RX/TIM1_CH4/ADC11) ; port TIM1_CH4/OUTPUT7
NetU8_36: U8.36(PA10/USART1_RX/TIM1_CH3) ; port TIM1_CH3/OUTPUT8

Not connected (* = marked no-connect by the designer): U8 2(VBAT)*

### Notes on the sheet
- 音频1&2
- 无线
- 485
- 设 计
- 制 图
- 审 核
- 类 别
- 签  字
- 日 期
- 产 品
- 名 称
- 零 件
- 板  名
- 数  量
- 共  张
- 第  张
- 批 准
- 文件编号
- 沈阳市创奇游乐设备有限公司
- (in symbol CSW-8P) NO
- (in symbol STM32F103_Mod_LQFP64) 西; 北; 南; 东

### Library data of the parts
JP1 = Header 6: 6P接插件; 版权归属: 源创客; BOM名称: 6P接插件; 学习资源: www.ooocke.com
LED1 = LED
R7 = Res1
RP4 = RESNW_8/SIP9
SW1 = CSW-8P: 8路编码开关; 版权归属: 源创客; BOM名称: 8路编码开关; 学习资源: www.ooocke.com
U8 = STM32F103_Mod_LQFP64: STM32F103RCT6

## Sheet CAN.SchDoc
size A4
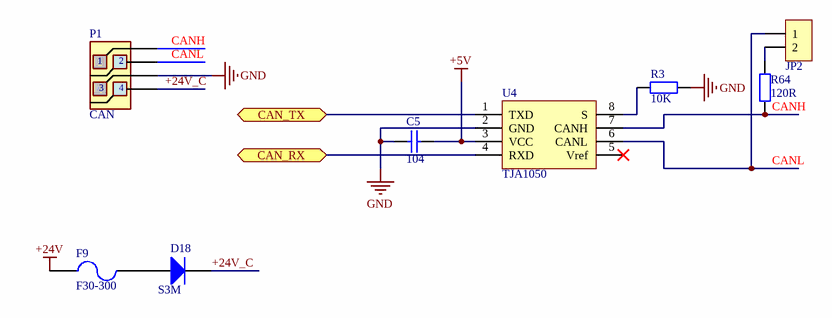
[diagram p7: CAN.SchDoc]

### Parts
C5  104  [C 0805]
D18  S3M  [SMC]
F9  F30-300  [FU 1812]
JP2  HDR-1X2  [HDR-1X2]  (value not drawn)
P1  CAN  [557-2x2]
R3  10K  [R 0805]
R64  120R  [R 0805]
U4  TJA1050  [SO8]

### Ports
CAN_RX, CAN_TX

### Nets
+5V: C5.2 U4.3(VCC)
+24V: F9.1
GND: C5.1 P1.3 R3.2 U4.2(GND)
+24V_C: D18.2 P1.4
CANH: P1.1 R64.2 U4.7(CANH)
CANL: JP2.1 P1.2 U4.6(CANL)
NetD18_1: D18.1 F9.2
NetJP2_2: JP2.2 R64.1
NetR3_1: R3.1 U4.8(S)
NetU4_1: U4.1(TXD) ; port CAN_TX
NetU4_4: U4.4(RXD) ; port CAN_RX

Not connected (* = marked no-connect by the designer): U4 5(Vref)*

### Notes on the sheet
- 设 计
- 制 图
- 审 核
- 类 别
- 签  字
- 日 期
- 产 品
- 名 称
- 零 件
- 板  名
- 数  量
- 共  张
- 第  张
- 批 准
- 文件编号
- 沈阳市创奇游乐设备有限公司

### Library data of the parts
C5 = Cap: Capacitor; Published: 8-Jun-2000; LatestRevisionDate: 17-Jul-2002; LatestRevisionNote: Re-released for DXP Platform.; Publisher: Altium Limited
D18 = Diode
F9 = Fuse 2: Fuse; Published: 8-Jun-2000; LatestRevisionDate: 17-Jul-2002; LatestRevisionNote: Re-released for DXP Platform.; PackageReference: PIN-W2/E2.8; Publisher: Altium Limited
JP2 = Header 2: 2P接插件; 版权归属: 源创客; BOM名称: 2P接插件; 学习资源: www.ooocke.com
P1 = CON4L
R3 R64 = Res1
U4 = SN65HVD230: CAN

## Sheet RS485.SchDoc
size A4
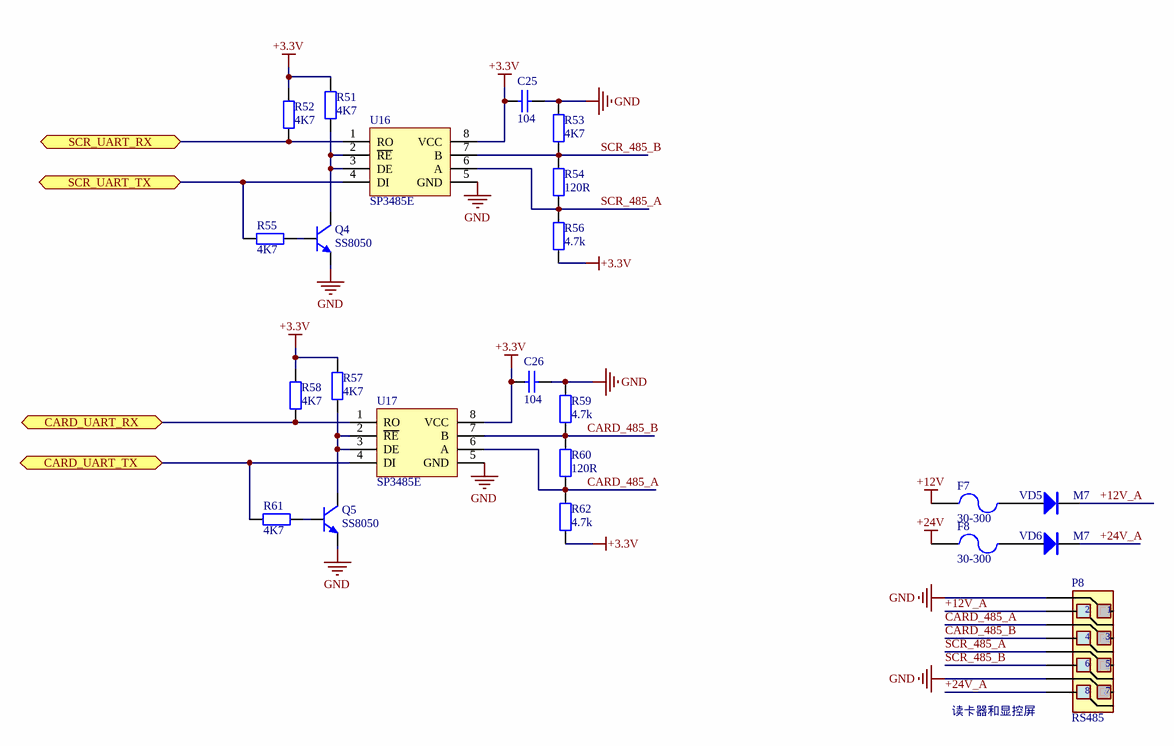
[diagram p8: RS485.SchDoc]

### Parts
C25  104  [C 0805]
C26  104  [C 0805]
F7  30-300  [FU 1812]
F8  30-300  [FU 1812]
P8  RS485  [557-2x4]
Q4  SS8050  [SOT23-3N]
Q5  SS8050  [SOT23-3N]
R51  4K7  [R 0805]
R52  4K7  [R 0805]
R53  4K7  [R 0805]
R54  120R  [R 0805]
R55  4K7  [R 0805]
R56  4.7k  [R 0805]
R57  4K7  [R 0805]
R58  4K7  [R 0805]
R59  4.7k  [R 0805]
R60  120R  [R 0805]
R61  4K7  [R 0805]
R62  4.7k  [R 0805]
U16  SP3485E  [SOP8_N]
U17  SP3485E  [SOP8_N]
VD5  M7  [SMA]
VD6  M7  [SMA]

### Ports
CARD_UART_RX (bidir), CARD_UART_TX (bidir), SCR_UART_RX (bidir), SCR_UART_TX (bidir)

### Nets
+3.3V: C25.2 C26.2 R51.2 R52.2 R56.1 R57.2 R58.2 R62.1 U16.8(VCC) U17.8(VCC)
+12V: F7.1
+24V: F8.1
GND: C25.1 C26.1 P8.1 P8.7 Q4.2(E) Q5.2(E) R53.2 R59.2 U16.5(GND) U17.5(GND)
+12V_A: P8.2 VD5.2(K)
+24V_A: P8.8 VD6.2(K)
CARD_485_A: P8.3 R60.1 R62.2 U17.6(A)
CARD_485_B: P8.4 R59.1 R60.2 U17.7(B)
SCR_485_A: P8.5 R54.1 R56.2 U16.6(A)
SCR_485_B: P8.6 R53.1 R54.2 U16.7(B)
NetF7_2: F7.2 VD5.1(A)
NetF8_2: F8.2 VD6.1(A)
NetQ4_1: Q4.1(B) R55.1
NetQ4_3: Q4.3(C) R51.1 U16.2(~{RE}) U16.3(DE)
NetQ5_1: Q5.1(B) R61.1
NetQ5_3: Q5.3(C) R57.1 U17.2(~{RE}) U17.3(DE)
NetR52_1: R52.1 U16.1(RO) ; port SCR_UART_RX
NetR55_2: R55.2 U16.4(DI) ; port SCR_UART_TX
NetR58_1: R58.1 U17.1(RO) ; port CARD_UART_RX
NetR61_2: R61.2 U17.4(DI) ; port CARD_UART_TX

### Notes on the sheet
- 读卡器和显控屏
- 设 计
- 制 图
- 审 核
- 类 别
- 签  字
- 日 期
- 产 品
- 名 称
- 零 件
- 板  名
- 数  量
- 共  张
- 第  张
- 批 准
- 文件编号
- 沈阳市创奇游乐设备有限公司

### Library data of the parts
C25 C26 = Cap1
F7 F8 = Fuse 2: Fuse; Published: 8-Jun-2000; LatestRevisionDate: 17-Jul-2002; LatestRevisionNote: Re-released for DXP Platform.; PackageReference: PIN-W2/E2.8; Publisher: Altium Limited
P8 = 557-2x4: 接插件
Q4 Q5 = 8050-SMD: as Q3 on sheet OUTPUT; BOM名称: 高频放大-NPN型; 学习资源: www.ooocke.com
R51-R62 = Res1
U16 U17 = SP3485
VD5 VD6 = M7: 整流二极管; 版权归属: 源创客; BOM名称: 整流二极管; 学习资源: www.ooocke.com

## Sheet WirelessModule.SchDoc
size A4
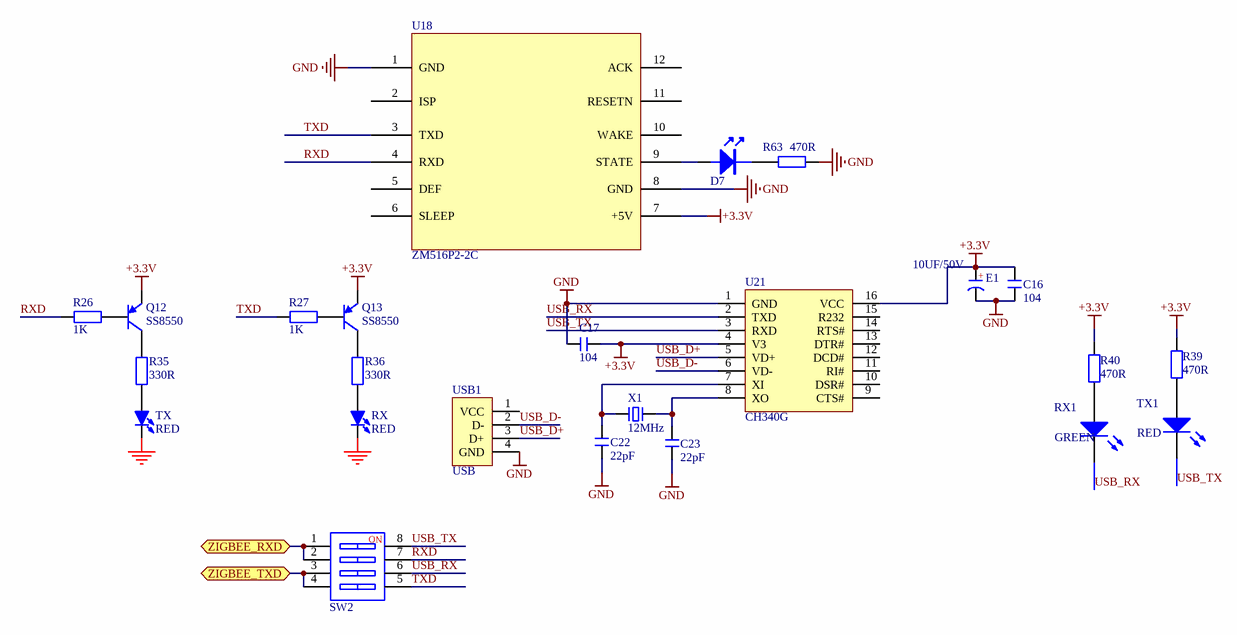
[diagram p9: WirelessModule.SchDoc]

### Parts
C16  104  [C 0805]
C17  104  [C 0805]
C22  22pF  [C 0805]
C23  22pF  [C 0805]
D7  RED  [LED 3MM-B]  (value not drawn)
E1  10UF/50V  [CAP 2.0*5*11]
Q12  SS8550  [SOT23-3N]
Q13  SS8550  [SOT23-3N]
R26  1K  [R 0805-HP]
R27  1K  [R 0805-HP]
R35  330R  [R 0805-HP]
R36  330R  [R 0805-HP]
R39  470R  [R 0805]
R40  470R  [R 0805]
R63  470R  [R 0805]
RX  RED  [LED 3MM-R]
RX1  GREEN  [LED 0805R]
SW2  CSW-4P  [CSW1.27 SMD-4P]  (value not drawn)
TX  RED  [LED 3MM-R]
TX1  RED  [LED 0805R]
U18  ZM516P2-2C  [ZM5168XP1-1C_ZJ]
U21  CH340G  [SO16]
USB1  USB  [USB-B/S_A]
X1  12MHz  [XTAL-5032 - 2P]

### Ports
ZIGBEE_RXD, ZIGBEE_TXD

### Nets
+3.3V: C16.2 C17.1 E1.1(A) Q12.2(E) Q13.2(E) R39.2 R40.2 U18.7(+5V) U21.4(V3) U21.16(VCC)
GND: C16.1 C17.2 C22.1 C23.1 E1.2(K) R63.2 RX.2(K) TX.2(K) U18.1(GND) U18.8(GND) U21.1(GND) USB1.4(GND)
RXD: R26.1 SW2.7 U18.4(RXD)
TXD: R27.1 SW2.5 U18.3(TXD)
USB_D+: U21.5(VD+) USB1.3(D+)
USB_D-: U21.6(VD-) USB1.2(D-)
USB_RX: RX1.2(K) SW2.6 U21.2(TXD)
USB_TX: SW2.8 TX1.2(K) U21.3(RXD)
NetC22_2: C22.2 U21.7(XI) X1.1
NetC23_2: C23.2 U21.8(XO) X1.2
NetD7_1: D7.1 U18.9(STATE)
NetD7_2: D7.2 R63.1
NetQ12_1: Q12.1(B) R26.2
NetQ12_3: Q12.3(C) R35.1
NetQ13_1: Q13.1(B) R27.2
NetQ13_3: Q13.3(C) R36.1
NetR35_2: R35.2 TX.1(A)
NetR36_2: R36.2 RX.1(A)
NetR39_1: R39.1 TX1.1(A)
NetR40_1: R40.1 RX1.1(A)
NetSW2_1: SW2.1 SW2.2 ; port ZIGBEE_RXD
NetSW2_3: SW2.3 SW2.4 ; port ZIGBEE_TXD

Not connected (* = marked no-connect by the designer): U18 2(ISP) 5(DEF) 6(SLEEP) 10(WAKE) 11(RESETN) 12(ACK); U21 9(CTS#) 10(DSR#) 11(RI#) 12(DCD#) 13(DTR#) 14(RTS#) 15(R232); USB1 1(VCC)

### Notes on the sheet
- 设 计
- 制 图
- 审 核
- 类 别
- 签  字
- 日 期
- 产 品
- 名 称
- 零 件
- 板  名
- 数  量
- 共  张
- 第  张
- 批 准
- 文件编号
- 沈阳市创奇游乐设备有限公司
- (in symbol C-CAP) +
- (in symbol CSW-4P) NO

### Library data of the parts
C16 C17 C22 C23 = C: 无极性贴片电容; 版权归属: 源创客; BOM名称: 无极性贴片电容; 学习资源: www.ooocke.com
D7 RX1 TX1 = LED
E1 = C-CAP: 直插电解电容; 版权归属: 源创客; BOM名称: 直插电解电容; 学习资源: www.ooocke.com
Q12 Q13 = 8550-SMD: 高频放大-PNP型; 版权归属: 源创客; 属性: 40V 1.5A 1W 100MHZ; BOM名称: 高频放大-PNP型; 学习资源: www.ooocke.com
R26 R27 R35 R36 R63 = R: 贴片电阻; 版权归属: 源创客; BOM名称: 贴片电阻; 学习资源: www.ooocke.com
R39 R40 = Res1
RX TX = LED-5MM: 5mm插件LED; 版权归属: 源创客; BOM名称: 5mm插件LED; 学习资源: www.ooocke.com
SW2 = CSW-4P: 4路编码开关; 版权归属: 源创客; BOM名称: 4路编码开关; 学习资源: www.ooocke.com
U18 = ZM516P2-2C转接
USB1 = USB-A/S: USB-A型母接口; 版权归属: 源创客; BOM名称: USB-A型母接口; 学习资源: www.ooocke.com
X1 = XTAL-2: 2脚晶振; 版权归属: 源创客; BOM名称: 2脚晶振; 学习资源: www.ooocke.com

## Nets that join several sheets
+3.3V: INPUT (R1.1 R2.1 RP2.1), POWER (5 pins), MCU (5 pins), RS485 (10 pins), WirelessModule (10 pins)
+5V: AUDIO (D1.1), IR (7 pins), POWER (C12.1 C14.1 U13.3), CAN (C5.2 U4.3)
+12V: IR (F2.1), OUTPUT (12 pins), POWER (7 pins), RS485 (F7.1)
+24V: AUDIO (U1.1), INPUT (F1.1 R24.1 R25.1 RP3.1), OUTPUT (D5.2 K1.5 R32.1), POWER (C9.1 C10.1 L1.2 R30.1), CAN (F9.1), RS485 (F8.1)
GND: AUDIO (5 pins), INPUT (11 pins), IR (6 pins), OUTPUT (32 pins), POWER (25 pins), MCU (13 pins), CAN (C5.1 P1.3 R3.2 U4.2), RS485 (10 pins), WirelessModule (12 pins)
PWR: OUTPUT (10 pins), POWER (D6.1 F6.1)
NetR1_2: INPUT (R1.2 U20.8), MCU (U8.15)
NetR2_2: INPUT (R2.2 U20.6), MCU (U8.16)
NetR37_2: OUTPUT (R37.2), MCU (U8.38)
NetR52_1: MCU (U8.43), RS485 (R52.1 U16.1)
NetR55_2: MCU (U8.44), RS485 (R55.2 U16.4)
NetR58_1: MCU (U8.48), RS485 (R58.1 U17.1)
NetR61_2: MCU (U8.46), RS485 (R61.2 U17.4)
NetRP2_2: INPUT (RP2.2 U5.16), MCU (U8.17)
NetRP2_3: INPUT (RP2.3 U5.14), MCU (U8.18)
NetRP2_4: INPUT (RP2.4 U5.12), MCU (U8.19)
NetRP2_5: INPUT (RP2.5 U5.10), MCU (U8.20)
NetSW2_1: MCU (U8.24), WirelessModule (SW2.1 SW2.2)
NetSW2_3: MCU (U8.23), WirelessModule (SW2.3 SW2.4)
NetU2_7: AUDIO (U2.7), MCU (U8.51)
NetU2_8: AUDIO (U2.8), MCU (U8.52)
NetU2_9: AUDIO (U2.9), MCU (U8.12)
NetU3_7: AUDIO (U3.7), MCU (U8.14)
NetU3_8: AUDIO (U3.8), MCU (U8.11)
NetU3_9: AUDIO (U3.9), MCU (U8.13)
NetU4_1: MCU (U8.53), CAN (U4.1)
NetU4_4: MCU (U8.54), CAN (U4.4)
NetU6_7: IR (U6.7), MCU (U8.27)
NetU6_8: IR (U6.8), MCU (U8.28)
NetU6_12: IR (U6.12), MCU (U8.50)
NetU6_13: IR (U6.13), MCU (U8.49)
NetU6_14: IR (U6.14), MCU (U8.26)
NetU6_15: IR (U6.15), MCU (U8.25)
NetU6_19: IR (U6.19), MCU (U8.22)
NetU8_29: OUTPUT (U9.4), MCU (U8.29)
NetU8_30: OUTPUT (U9.2), MCU (U8.30)
NetU8_31: OUTPUT (U10.4), MCU (U8.31)
NetU8_32: OUTPUT (U10.2), MCU (U8.32)
NetU8_33: OUTPUT (U11.4), MCU (U8.33)
NetU8_34: OUTPUT (U11.2), MCU (U8.34)
NetU8_35: OUTPUT (U19.4), MCU (U8.35)
NetU8_36: OUTPUT (U19.2), MCU (U8.36)